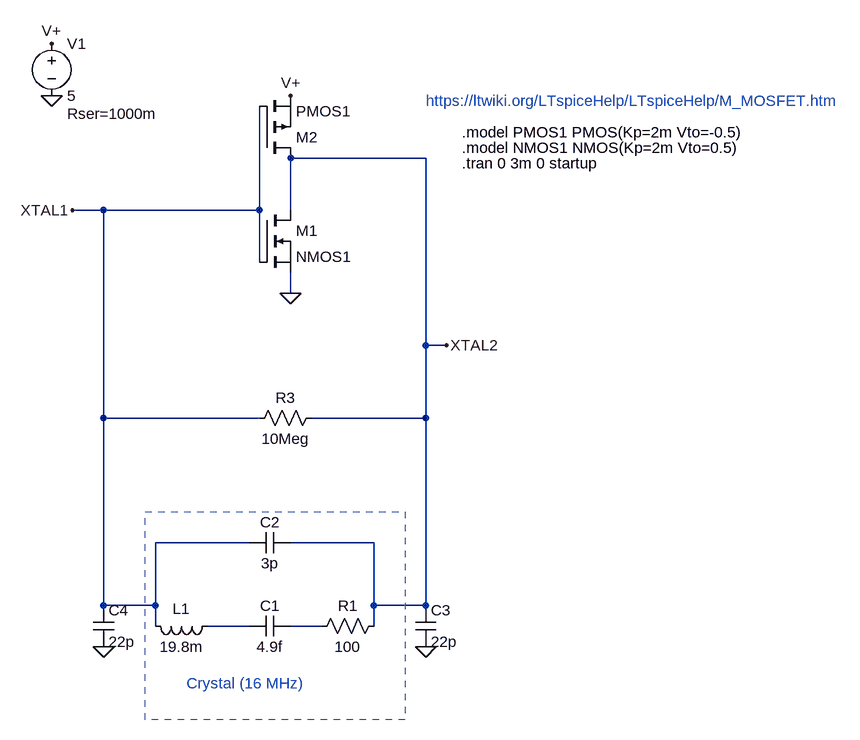
[diagram p0: schematic xtal_16mhz.asc]
xtal_16mhz.asc, the LTspice schematic file:
Version 4.1
SHEET 1 3048 2472
WIRE 2272 1424 2064 1424
WIRE 1776 1504 1728 1504
WIRE 2016 1504 2016 1344
WIRE 2016 1504 1776 1504
WIRE 2064 1504 2064 1424
WIRE 2016 1584 2016 1504
WIRE 2064 1632 2064 1600
WIRE 2272 1712 2272 1424
WIRE 2304 1712 2272 1712
WIRE 1776 1824 1776 1504
WIRE 2016 1824 1776 1824
WIRE 2272 1824 2272 1712
WIRE 2272 1824 2096 1824
WIRE 2000 2016 1856 2016
WIRE 2192 2016 2064 2016
WIRE 1776 2112 1776 1824
WIRE 1856 2112 1856 2016
WIRE 1856 2112 1776 2112
WIRE 2192 2112 2192 2016
WIRE 2272 2112 2272 1824
WIRE 2272 2112 2192 2112
WIRE 1856 2144 1856 2112
WIRE 2000 2144 1936 2144
WIRE 2112 2144 2064 2144
WIRE 2192 2144 2192 2112
FLAG 1776 2176 0
FLAG 2272 2176 0
FLAG 1696 1328 0
FLAG 1696 1248 V+
FLAG 2304 1712 XTAL2
FLAG 2064 1328 V+
FLAG 1728 1504 XTAL1
FLAG 2064 1632 0
SYMBOL ind 1952 2128 R90
WINDOW 0 5 56 VBottom 2
WINDOW 3 32 56 VTop 2
SYMATTR InstName L1
SYMATTR Value 19.8m
SYMBOL cap 2064 2128 R90
WINDOW 0 0 32 VBottom 2
WINDOW 3 32 32 VTop 2
SYMATTR InstName C1
SYMATTR Value 4.9f
SYMBOL res 2208 2128 R90
WINDOW 0 0 56 VBottom 2
WINDOW 3 32 56 VTop 2
SYMATTR InstName R1
SYMATTR Value 100
SYMBOL cap 2064 2000 R90
WINDOW 0 0 32 VBottom 2
WINDOW 3 32 32 VTop 2
SYMATTR InstName C2
SYMATTR Value 3p
SYMBOL cap 2256 2112 R0
SYMATTR InstName C3
SYMATTR Value 22p
SYMBOL cap 1760 2112 R0
SYMATTR InstName C4
SYMATTR Value 22p
SYMBOL res 2112 1808 R90
WINDOW 0 0 56 VBottom 2
WINDOW 3 32 56 VTop 2
SYMATTR InstName R3
SYMATTR Value 10Meg
SYMBOL voltage 1696 1232 R0
WINDOW 123 0 0 Left 0
WINDOW 39 24 124 Left 2
SYMATTR SpiceLine Rser=1000m
SYMATTR InstName V1
SYMATTR Value 5
SYMBOL nmos 2016 1504 R0
SYMATTR InstName M1
SYMATTR Value NMOS1
SYMBOL pmos 2016 1424 M180
SYMATTR InstName M2
SYMATTR Value PMOS1
TEXT 2328 1432 Left 2 !.tran 0 3m 0 startup
TEXT 1904 2232 Left 2 ;Crystal (16 MHz)
TEXT 2328 1384 Left 2 !.model PMOS1 PMOS(Kp=2m Vto=-0.5)
TEXT 2328 1408 Left 2 !.model NMOS1 NMOS(Kp=2m Vto=0.5)
TEXT 2272 1336 Left 2 ;https://ltwiki.org/LTspiceHelp/LTspiceHelp/M_MOSFET.htm
RECTANGLE Normal 2240 2288 1840 1968 2

The netlist it stands for:
* xtal_16mhz.asc
L1 N001 XTAL1 19.8m
C1 N002 N001 4.9f
R1 XTAL2 N002 100
C2 XTAL2 XTAL1 3p
C3 XTAL2 0 22p
C4 XTAL1 0 22p
R3 XTAL2 XTAL1 10Meg
V1 V+ 0 5 Rser=1000m
M1 XTAL2 XTAL1 0 0 NMOS1
M2 XTAL2 XTAL1 V+ V+ PMOS1
.model NMOS NMOS
.model PMOS PMOS
.lib standard.mos
.tran 0 3m 0 startup
* Crystal (16 MHz)
.model PMOS1 PMOS(Kp=2m Vto=-0.5)
.model NMOS1 NMOS(Kp=2m Vto=0.5)
* https://ltwiki.org/LTspiceHelp/LTspiceHelp/M_MOSFET.htm
.backanno
.end